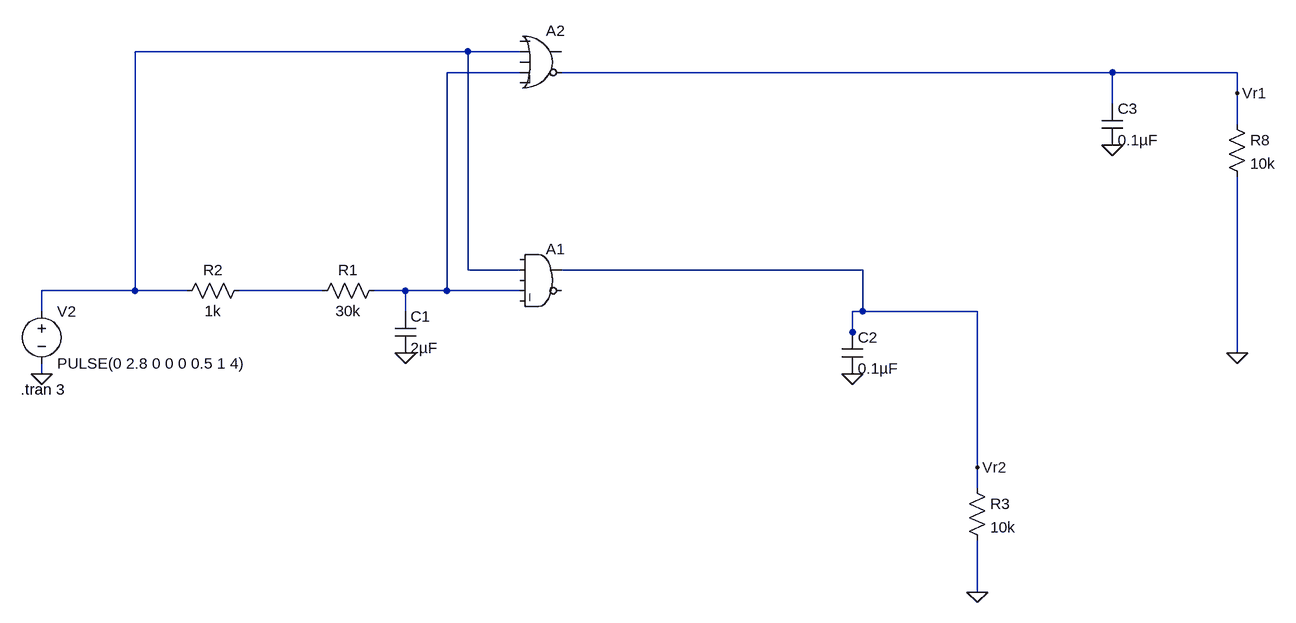
[diagram p0: schematic spdt-emul.asc]
spdt-emul.asc, the LTspice schematic file:
Version 4
SHEET 1 1908 680
WIRE -144 -416 -656 -416
WIRE -64 -416 -144 -416
WIRE -64 -384 -176 -384
WIRE 848 -384 0 -384
WIRE 1040 -384 848 -384
WIRE 1040 -352 1040 -384
WIRE 848 -336 848 -384
WIRE 1040 -304 1040 -352
WIRE -144 -80 -144 -416
WIRE -64 -80 -144 -80
WIRE 464 -80 0 -80
WIRE -656 -48 -656 -416
WIRE -656 -48 -800 -48
WIRE -576 -48 -656 -48
WIRE -368 -48 -496 -48
WIRE -240 -48 -288 -48
WIRE -176 -48 -176 -384
WIRE -176 -48 -240 -48
WIRE -64 -48 -176 -48
WIRE -800 -16 -800 -48
WIRE -240 -16 -240 -48
WIRE 464 -16 464 -80
WIRE 464 -16 448 -16
WIRE 640 -16 464 -16
WIRE 448 16 448 -16
WIRE 448 32 448 16
WIRE 1040 48 1040 -224
WIRE -800 80 -800 64
WIRE 640 224 640 -16
WIRE 640 256 640 224
WIRE 640 416 640 336
FLAG -240 48 0
FLAG -800 80 0
FLAG 640 416 0
FLAG 640 224 Vr2
FLAG 448 80 0
FLAG 1040 48 0
FLAG 848 -272 0
FLAG 1040 -352 Vr1
SYMBOL voltage -800 -32 R0
WINDOW 123 0 0 Left 0
WINDOW 39 0 0 Left 0
SYMATTR InstName V2
SYMATTR Value PULSE(0 2.8 0 0 0 0.5 1 4)
SYMBOL res -480 -64 R90
WINDOW 0 0 56 VBottom 2
WINDOW 3 32 56 VTop 2
SYMATTR InstName R2
SYMATTR Value 1k
SYMBOL res 624 240 R0
SYMATTR InstName R3
SYMATTR Value 10k
SYMBOL cap 432 16 R0
SYMATTR InstName C2
SYMATTR Value 0.1µF
SYMBOL res 1024 -320 R0
SYMATTR InstName R8
SYMATTR Value 10k
SYMBOL cap 832 -336 R0
SYMATTR InstName C3
SYMATTR Value 0.1µF
SYMBOL Digital\\and -32 -128 R0
SYMATTR InstName A1
SYMBOL Digital\\or -32 -464 R0
SYMATTR InstName A2
SYMBOL cap -256 -16 R0
SYMATTR InstName C1
SYMATTR Value 2µF
SYMBOL res -272 -64 R90
WINDOW 0 0 56 VBottom 2
WINDOW 3 32 56 VTop 2
SYMATTR InstName R1
SYMATTR Value 30k
TEXT -832 104 Left 2 !.tran 3

The netlist it stands for:
* spdt-emul.asc
V2 N001 0 PULSE(0 2.8 0 0 0 0.5 1 4)
R2 N003 N001 1k
R3 Vr2 0 10k
C2 Vr2 0 0.1µF
R8 Vr1 0 10k
C3 Vr1 0 0.1µF
A1 0 N001 0 N002 0 0 Vr2 0 AND
A2 0 N001 0 N002 0 Vr1 0 0 OR
C1 N002 0 2µF
R1 N002 N003 30k
.tran 3
.backanno
.end